# EAGLE schematic eTapper1main30 (EAGLE 8.3.2)
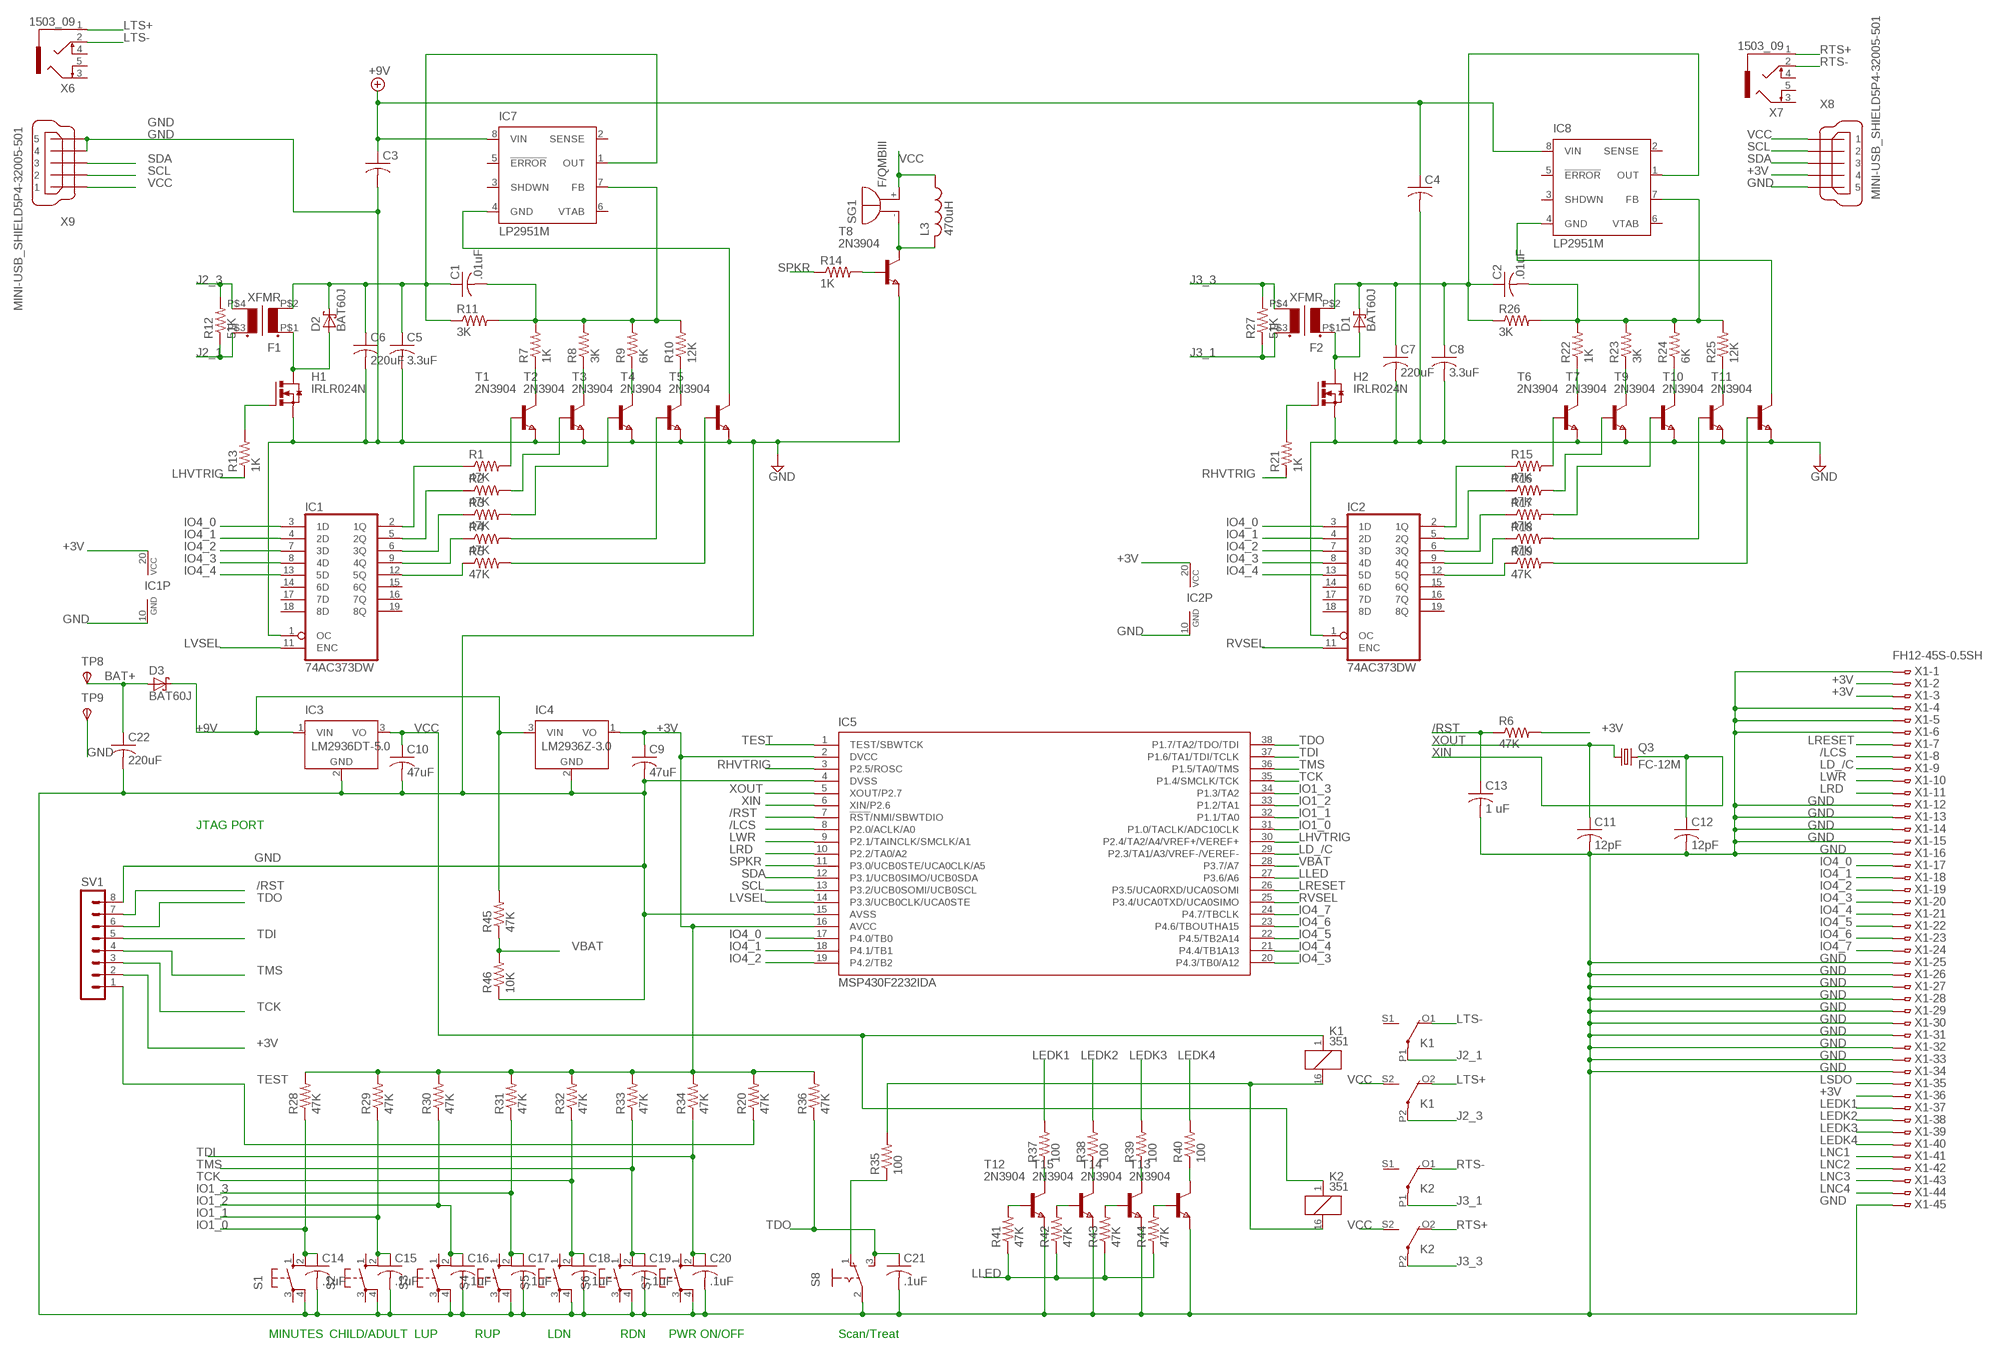
[diagram p0: schematic, sheet 1]

## Parts
C1  .01uF  C-USC0805  [C0805]
C2  .01uF  C-USC0805  [C0805]
C3  C-USC0805  [C0805]
C4  C-USC0805  [C0805]
C5  3.3uF  C-USC0805  [C0805]
C6  220uF  C-USC0805  [C0805]
C7  220uF  C-USC0805  [C0805]
C8  3.3uF  C-USC0805  [C0805]
C9  47uF  C-USC0805  [C0805]
C10  47uF  C-USC0805  [C0805]
C11  12pF  C-USC0805  [C0805]
C12  12pF  C-USC0805  [C0805]
C13  1 uF  C-USC0805  [C0805]
C14  .1uF  C-USC0805  [C0805]
C15  .1uF  C-USC0805  [C0805]
C16  .1uF  C-USC0805  [C0805]
C17  .1uF  C-USC0805  [C0805]
C18  .1uF  C-USC0805  [C0805]
C19  .1uF  C-USC0805  [C0805]
C20  .1uF  C-USC0805  [C0805]
C21  .1uF  C-USC0805  [C0805]
C22  220uF  C-USC0805  [C0805]
D1  BAT60J  [SOD323_ST]
D2  BAT60J  [SOD323_ST]
D3  BAT60J  [SOD323_ST]
F1  XFMR  [XFMR]
F2  XFMR  [XFMR]
H1  IRLR024N  [D-PAK_TO252AA]
H2  IRLR024N  [D-PAK_TO252AA]
IC1  74AC373DW  [SO20W]
IC2  74AC373DW  [SO20W]
IC3  LM2936DT-5.0  [TO252]
IC4  LM2936Z-3.0  [TO92]
IC5  MSP430F2232IDA  [TSSOP38_R-PDSO-G38-DA]
IC7  LP2951M  [SO08]
IC8  LP2951M  [SO08]
K1  351  [351]
K2  351  [351]
L3  470uH  L-USL2825P  [L2825P]
Q3  FC-12M  [FC-12M]
R1  47K  R-US_R0402  [R0402]
R2  47K  R-US_R0402  [R0402]
R3  47K  R-US_R0402  [R0402]
R4  47K  R-US_R0402  [R0402]
R5  47K  R-US_R0402  [R0402]
R6  47K  R-US_R0402  [R0402]
R7  1K  R-US_R0402  [R0402]
R8  3K  R-US_R0402  [R0402]
R9  6K  R-US_R0402  [R0402]
R10  12K  R-US_R0402  [R0402]
R11  3K  R-US_R0402  [R0402]
R12  51K  R-US_R0402  [R0402]
R13  1K  R-US_R0402  [R0402]
R14  1K  R-US_R0402  [R0402]
R15  47K  R-US_R0402  [R0402]
R16  47K  R-US_R0402  [R0402]
R17  47K  R-US_R0402  [R0402]
R18  47K  R-US_R0402  [R0402]
R19  47K  R-US_R0402  [R0402]
R20  47K  R-US_R0402  [R0402]
R21  1K  R-US_R0402  [R0402]
R22  1K  R-US_R0402  [R0402]
R23  3K  R-US_R0402  [R0402]
R24  6K  R-US_R0402  [R0402]
R25  12K  R-US_R0402  [R0402]
R26  3K  R-US_R0402  [R0402]
R27  51K  R-US_R0402  [R0402]
R28  47K  R-US_R0402  [R0402]
R29  47K  R-US_R0402  [R0402]
R30  47K  R-US_R0402  [R0402]
R31  47K  R-US_R0402  [R0402]
R32  47K  R-US_R0402  [R0402]
R33  47K  R-US_R0402  [R0402]
R34  47K  R-US_R0402  [R0402]
R35  100  R-US_R0402  [R0402]
R36  47K  R-US_R0402  [R0402]
R37  100  R-US_R0402  [R0402]
R38  100  R-US_R0402  [R0402]
R39  100  R-US_R0402  [R0402]
R40  100  R-US_R0402  [R0402]
R41  47K  R-US_R0402  [R0402]
R42  47K  R-US_R0402  [R0402]
R43  47K  R-US_R0402  [R0402]
R44  47K  R-US_R0402  [R0402]
R45  47K  R-US_R0402  [R0402]
R46  10K  R-US_R0402  [R0402]
S1  10-XX  [B3F-10XX]
S2  10-XX  [B3F-10XX]
S3  10-XX  [B3F-10XX]
S4  10-XX  [B3F-10XX]
S5  10-XX  [B3F-10XX]
S6  10-XX  [B3F-10XX]
S7  10-XX  [B3F-10XX]
S8  M251  [M251]
SG1  F/QMBIII  [F/QMBIII]
SV1  MA08-1  [MA08-1]
T1  2N3904  NPNSOT23  [SOT-23]
T2  2N3904  NPNSOT23  [SOT-23]
T3  2N3904  NPNSOT23  [SOT-23]
T4  2N3904  NPNSOT23  [SOT-23]
T5  2N3904  NPNSOT23  [SOT-23]
T6  2N3904  NPNSOT23  [SOT-23]
T7  2N3904  NPNSOT23  [SOT-23]
T8  2N3904  NPNSOT23  [SOT-23]
T9  2N3904  NPNSOT23  [SOT-23]
T10  2N3904  NPNSOT23  [SOT-23]
T11  2N3904  NPNSOT23  [SOT-23]
T12  2N3904  NPNSOT23  [SOT-23]
T13  2N3904  NPNSOT23  [SOT-23]
T14  2N3904  NPNSOT23  [SOT-23]
T15  2N3904  NPNSOT23  [SOT-23]
TP8  TPSTP06R  [TP06R]
TP9  TPSTP06R  [TP06R]
X1  FH12-45S-0.5SH  [FH12-45S-0.5SH]
X6  1503_09  [1503_09]
X7  1503_09  [1503_09]
X8  MINI-USB_SHIELD5P4-32005-501  [32005-501]
X9  MINI-USB_SHIELD5P4-32005-501  [32005-501]

## Nets
+3V: C9.1 IC1.20(VCC) IC2.20(VCC) IC4.1(VO) IC5.2(DVCC) IC5.16(AVCC) R6.2 R20.2 R28.2 R29.2 R30.2 R31.2 R32.2 R33.2 R34.2 R36.2 SV1.2 X1.2 X1.3 X1.36 X8.4
+9V: C3.1 C4.1 D3.C IC3.1(VIN) IC4.3(VIN) IC7.8(VIN) IC8.8(VIN) R45.2
/LCS: IC5.8(P2.0/ACLK/A0) X1.8
/RST: C13.1 IC5.7(!RST!/NMI/SBWTDIO) R6.1 SV1.7
BAT+: C22.1 D3.A TP8.TP(PP)
GND: C3.2 C4.2 C5.2 C6.2 C7.2 C8.2 C9.2 C10.2 C11.2 C12.2 C13.2 C14.2 C15.2 C16.2 C17.2 C18.2 C19.2 C20.2 C21.2 C22.2 H1.3(S) H2.3(S) IC1.1(OC) IC1.10(GND) IC2.1(OC) IC2.10(GND) IC3.2(GND) IC4.2(GND) IC5.4(DVSS) IC5.15(AVSS) R46.1 S1.4(P1) S2.4(P1) S3.4(P1) S4.4(P1) S5.4(P1) S6.4(P1) S7.4(P1) S8.2(P) SV1.8 T1.2(E) T2.2(E) T3.2(E) T4.2(E) T5.2(E) T6.2(E) T7.2(E) T8.2(E) T9.2(E) T10.2(E) T11.2(E) T12.2(E) T13.2(E) T14.2(E) T15.2(E) TP9.TP(PP) X1.1 X1.4 X1.5 X1.6 X1.12 X1.13 X1.14 X1.15 X1.16 X1.25 X1.26 X1.27 X1.28 X1.29 X1.30 X1.31 X1.32 X1.33 X1.34 X1.45 X8.5 X9.4 X9.5
IO1_0: C14.1 IC5.31(P1.0/TACLK/ADC10CLK) R28.1 S1.2(S1)
IO1_1: C15.1 IC5.32(P1.1/TA0) R29.1 S2.2(S1)
IO1_2: C16.1 IC5.33(P1.2/TA1) R30.1 S3.2(S1)
IO1_3: C17.1 IC5.34(P1.3/TA2) R31.1 S4.2(S1)
IO4_0: IC1.3(1D) IC2.3(1D) IC5.17(P4.0/TB0) X1.17
IO4_1: IC1.4(2D) IC2.4(2D) IC5.18(P4.1/TB1) X1.18
IO4_2: IC1.7(3D) IC2.7(3D) IC5.19(P4.2/TB2) X1.19
IO4_3: IC1.8(4D) IC2.8(4D) IC5.20(P4.3/TB0/A12) X1.20
IO4_4: IC1.13(5D) IC2.13(5D) IC5.21(P4.4/TB1A13) X1.21
IO4_5: IC5.22(P4.5/TB2A14) X1.22
IO4_6: IC5.23(P4.6/TBOUTHA15) X1.23
IO4_7: IC5.24(P4.7/TBCLK) X1.24
J2_1: F1.P$3(S1) K1.P1(2:P) R12.1
J2_3: F1.P$4(S2) K1.P2(3:P) R12.2
J3_1: F2.P$3(S1) K2.P1(2:P) R27.1
J3_3: F2.P$4(S2) K2.P2(3:P) R27.2
LD_/C: IC5.29(P2.3/TA1/A3/VREF-/VEREF-) X1.9
LEDK1: R37.2 X1.37
LEDK2: R38.2 X1.38
LEDK3: R39.2 X1.39
LEDK4: R40.2 X1.40
LHVTRIG: IC5.30(P2.4/TA2/A4/VREF+/VEREF+) R13.1
LLED: IC5.27(P3.6/A6) R41.1 R42.1 R43.1 R44.1
LNC1: X1.41
LNC2: X1.42
LNC3: X1.43
LNC4: X1.44
LRD: IC5.10(P2.2/TA0/A2) X1.11
LRESET: IC5.26(P3.5/UCA0RXD/UCA0SOMI) X1.7
LSDO: X1.35
LTS+: K1.O2(3:O) X6.1
LTS-: K1.O1(2:O) X6.2
LVSEL: IC1.11(ENC) IC5.14(P3.3/UCB0CLK/UCA0STE)
LWR: IC5.9(P2.1/TAINCLK/SMCLK/A1) X1.10
N$1: IC1.2(1Q) R1.1
N$2: IC1.5(2Q) R2.1
N$3: IC1.6(3Q) R3.1
N$4: IC1.9(4Q) R4.1
N$5: IC1.12(5Q) R5.1
N$6: L3.2 SG1.-(+) T8.1(C)
N$7: R4.2 T4.3(B)
N$8: R5.2 T5.3(B)
N$9: D2.A F1.P$1(P1) H1.4(D)
N$10: R7.1 T1.1(C)
N$11: R8.1 T2.1(C)
N$12: R9.1 T3.1(C)
N$13: R1.2 T1.3(B)
N$14: R2.2 T2.3(B)
N$15: R3.2 T3.3(B)
N$16: R10.1 T4.1(C)
N$17: C1.2 IC7.7(FB) R7.2 R8.2 R9.2 R10.2 R11.2
N$18: C1.1 C5.1 C6.1 D2.C F1.P$2(P2) IC7.1(OUT) R11.1
N$19: D1.A F2.P$1(P1) H2.4(D)
N$20: IC2.2(1Q) R15.1
N$21: H1.1(G) R13.2
N$22: R14.2 T8.3(B)
N$23: R35.1 S8.1(O)
N$24: IC2.5(2Q) R16.1
N$25: IC2.6(3Q) R17.1
N$26: IC2.9(4Q) R18.1
N$27: IC2.12(5Q) R19.1
N$28: R44.2 T13.3(B)
N$29: R15.2 T6.3(B)
N$30: R16.2 T7.3(B)
N$31: R17.2 T9.3(B)
N$32: R18.2 T10.3(B)
N$33: R19.2 T11.3(B)
N$34: K1.16 K2.16 R35.2
N$35: R22.1 T6.1(C)
N$36: R23.1 T7.1(C)
N$37: R24.1 T9.1(C)
N$38: R25.1 T10.1(C)
N$39: C2.2 IC8.7(FB) R22.2 R23.2 R24.2 R25.2 R26.2
N$40: C2.1 C7.1 C8.1 D1.C F2.P$2(P2) IC8.1(OUT) R26.1
N$41: R37.1 T12.1(C)
N$42: H2.1(G) R21.2
N$43: R38.1 T15.1(C)
N$44: R39.1 T14.1(C)
N$45: IC7.4(GND) T5.1(C)
N$46: R40.1 T13.1(C)
N$47: IC8.4(GND) T11.1(C)
N$48: R43.2 T14.3(B)
N$49: R41.2 T12.3(B)
N$50: R42.2 T15.3(B)
RHVTRIG: IC5.3(P2.5/ROSC) R21.1
RTS+: K2.O2(3:O) X7.1
RTS-: K2.O1(2:O) X7.2
RVSEL: IC2.11(ENC) IC5.25(P3.4/UCA0TXD/UCA0SIMO)
SCL: IC5.13(P3.2/UCB0SOMI/UCB0SCL) X8.2 X9.2
SDA: IC5.12(P3.1/UCB0SIMO/UCB0SDA) X8.3 X9.3
SPKR: IC5.11(P3.0/UCB0STE/UCA0CLK/A5) R14.1
TCK: C18.1 IC5.35(P1.4/SMCLK/TCK) R32.1 S5.2(S1) SV1.3
TDI: C20.1 IC5.37(P1.6/TA1/TDI/TCLK) R34.1 S7.2(S1) SV1.5
TDO: C21.1 IC5.38(P1.7/TA2/TDO/TDI) R36.1 S8.3(S) SV1.6
TEST: IC5.1(TEST/SBWTCK) R20.1 SV1.1
TMS: C19.1 IC5.36(P1.5/TA0/TMS) R33.1 S6.2(S1) SV1.4
VBAT: IC5.28(P3.7/A7) R45.1 R46.2
VCC: C10.1 IC3.3(VO) K1.1 K1.S2(3:S) K2.1 K2.S2(3:S) L3.1 SG1.+(-) X8.1 X9.1
XIN: C12.1 IC5.6(XIN/P2.6) Q3.2
XOUT: C11.1 IC5.5(XOUT/P2.7) Q3.1
Unconnected: IC1.14(6D) IC1.15(6Q) IC1.16(7Q) IC1.17(7D) IC1.18(8D) IC1.19(8Q) IC2.14(6D) IC2.15(6Q) IC2.16(7Q) IC2.17(7D) IC2.18(8D) IC2.19(8Q) IC7.2(SENSE) IC7.3(SHDWN) IC7.5(!ERROR) IC7.6(VTAB) IC8.2(SENSE) IC8.3(SHDWN) IC8.5(!ERROR) IC8.6(VTAB) K1.S1(2:S) K2.S1(2:S) S1.1(S) S1.3(P) S2.1(S) S2.3(P) S3.1(S) S3.3(P) S4.1(S) S4.3(P) S5.1(S) S5.3(P) S6.1(S) S6.3(P) S7.1(S) S7.3(P) X6.3 X6.4 X6.5 X7.3 X7.4 X7.5 X8.M1(S1) X8.M2(S2) X8.M3(S3) X8.M4(S4) X9.M1(S1) X9.M2(S2) X9.M3(S3) X9.M4(S4)

## Notes on the sheet
- JTAG PORT
- MINUTES | CHILD/ADULT | LUP | RUP | LDN | RDN | PWR ON/OFF | Scan/Treat

## Library data of the parts
C1-C22 = rcl:C-US: CAPACITOR, American symbol
D1-D3 = diode:BAT60J: Schottky barrier diode Source: www.st.com, BAT60J.pdf
F1 F2 = XFMR1:XFMR: Transformer 1"X1" 0.4"X0.4" hole separation for e_tapper
H1 H2 = IRLR024N:IRLR024N: IRLR024N HEXFET Power Mosfet N channel Infeneon Technology TO-251AA IPAK
IC1 IC2 = 74xx-eu:74*373: Octal D type transparent LATCH, edge triggered
IC3 = national-semiconductor:LM2936?*: Ultra-Low Quiescent Current LDO Voltage Regulator Source: Data sheet <http://www.national.com/ds/LM/LM2936.pdf>; MF: NATIONAL SEMICONDUCTOR; MPN: LM2936DT-5.0/NOPB; OC_FARNELL: 1286864; OC_NEWARK: 41K4501
IC4 = national-semiconductor:LM2936?*: Ultra-Low Quiescent Current LDO Voltage Regulator Source: Data sheet <http://www.national.com/ds/LM/LM2936.pdf>; MF: NATIONAL SEMICONDUCTOR; MPN: LM2936Z-3.0/NOPB; OC_FARNELL: 1312709; OC_NEWARK: 41K4531
IC5 = texas:MSP430F22*2IDA: MIXED SIGNAL MICROCONTROLLER Source: http://focus.ti.com/lit/ds/symlink/msp430f2274.pdf; MPN: MSP430F2232IDA; OC_FARNELL: 1610178; OC_NEWARK: 28M6312
IC7 IC8 = national-semiconductor:LP2951: Adjustable Micropower Voltage Regulator Source: http://www.national.com/ds/LP/LP2950.pdf; MF: FAIRCHILD SEMICONDUCTOR; MPN: LP2951CM; OC_FARNELL: 9488561; OC_NEWARK: 78K6014
K1 K2 = relay:351: RELAY 2 x switch, Omron; OC_FARNELL: unknown; OC_NEWARK: unknown
L3 = rcl:L-US: INDUCTOR, American symbol
Q3 = crystal:FC-12M: kHz RANGE CRYSTAL UNIT LOW PROFILE SMD Source: Epson Toyocom FC-12M.pdf
R1-R46 = resistor:R-US_: RESISTOR, American symbol
S1-S7 = switch-omron:10-XX: OMRON SWITCH; MPN: B3F-1000; OC_FARNELL: 176432; OC_NEWARK: 36M3542
S8 = switch:M251: SLIDING SWITCH Mors, distributor Buerklin, 11G702
SG1 = buzzer:F/QMBIII: BUZZER Source: Buerklin; OC_FARNELL: unknown; OC_NEWARK: unknown
SV1 = con-lstb:MA08-1: PIN HEADER; OC_FARNELL: unknown; OC_NEWARK: unknown
T1-T15 = zetex:NPNSOT23: NPN TRANSISTOR; MPN: DSS20201L-7; OC_FARNELL: 1710688; OC_NEWARK: 25R4555
TP8 TP9 = testpad:TPS: TEST PIN
X1 = con-hirose:FH12-45S-0.5S: 0.5mm Pitch Connectors For FPC/FFC Source: Data sheet <http://www.hirose.co.jp/cataloge_hp/e58605370.pdf>; OC_FARNELL: unknown; OC_NEWARK: unknown
X6 X7 = con-lumberg:1503_09: Jack connectors according to JISC 6560, 3.5 mm Klinkeneinbaukupplung nach JISC 6560, 3,5 mm, 3-polig/ stereo, abgewinkelte Ausführung, mit 2 Öffnern und Lötaugen, für Leiterplatten Rückseitenmontage Source: http://www.lumberg.com/Produkte/PDFs/1503_09.pdf; OC_FARNELL: 1243244; OC_NEWARK: unknown
X8 X9 = con-cypressindustries:MINI-USB_SHIELD5P4-: MINI USB-B R/A W/O POST 5 pol. Source: www.cypressindustries.com; OC_FARNELL: unknown; OC_NEWARK: unknown

## Module LP2951
Ports: 

### Library data of the parts